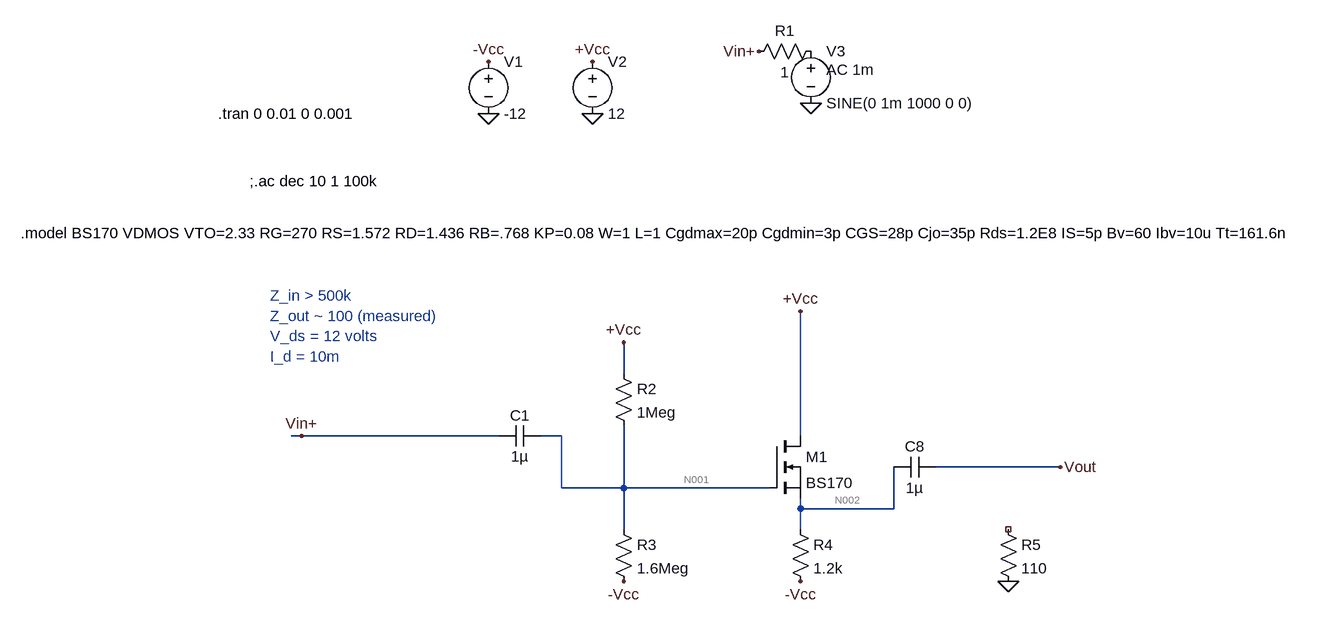
[diagram p0: schematic FET.asc]
FET.asc, the LTspice schematic file:
Version 4
SHEET 1 2740 1392
WIRE 256 688 256 640
WIRE -240 784 -256 784
WIRE 64 784 -240 784
WIRE 160 784 128 784
WIRE 528 784 528 592
WIRE 928 832 736 832
WIRE 160 864 160 784
WIRE 256 864 256 768
WIRE 256 864 160 864
WIRE 480 864 256 864
WIRE 528 896 528 880
WIRE 672 896 672 832
WIRE 672 896 528 896
WIRE 256 928 256 864
WIRE 528 928 528 896
FLAG 48 288 0
FLAG 208 288 0
FLAG 48 208 -Vcc
FLAG 208 208 +Vcc
FLAG 544 272 0
FLAG 464 192 Vin+
FLAG 256 640 +Vcc
FLAG 528 592 +Vcc
FLAG -240 784 Vin+
FLAG 928 832 Vout
FLAG 256 1008 -Vcc
FLAG 528 1008 -Vcc
FLAG 848 1008 0
SYMBOL voltage 48 192 R0
WINDOW 123 0 0 Left 0
WINDOW 39 0 0 Left 0
SYMATTR InstName V1
SYMATTR Value -12
SYMBOL voltage 208 192 R0
WINDOW 123 0 0 Left 0
WINDOW 39 0 0 Left 0
SYMATTR InstName V2
SYMATTR Value 12
SYMBOL voltage 544 176 R0
WINDOW 123 24 44 Left 2
WINDOW 39 0 0 Left 0
SYMATTR Value2 AC 1m
SYMATTR InstName V3
SYMATTR Value SINE(0 1m 1000 0 0)
SYMBOL res 560 176 R90
WINDOW 0 0 56 VBottom 2
WINDOW 3 32 56 VTop 2
SYMATTR InstName R1
SYMATTR Value 1
SYMBOL nmos 480 784 R0
SYMATTR InstName M1
SYMATTR Value BS170
SYMBOL res 240 672 R0
SYMATTR InstName R2
SYMATTR Value 1Meg
SYMBOL res 240 912 R0
SYMATTR InstName R3
SYMATTR Value 1.6Meg
SYMBOL res 512 912 R0
SYMATTR InstName R4
SYMATTR Value 1.2k
SYMBOL cap 736 816 R90
WINDOW 0 0 32 VBottom 2
WINDOW 3 32 32 VTop 2
SYMATTR InstName C8
SYMATTR Value 1µ
SYMBOL cap 128 768 R90
WINDOW 0 0 32 VBottom 2
WINDOW 3 32 32 VTop 2
SYMATTR InstName C1
SYMATTR Value 1µ
SYMBOL res 832 912 R0
SYMATTR InstName R5
SYMATTR Value 110
TEXT -368 288 Left 2 !.tran 0 0.01 0 0.001
TEXT -672 472 Left 2 !.model BS170 VDMOS VTO=2.33 RG=270 RS=1.572 RD=1.436 RB=.768 KP=0.08 W=1 L=1 Cgdmax=20p Cgdmin=3p CGS=28p Cjo=35p Rds=1.2E8 IS=5p Bv=60 Ibv=10u Tt=161.6n
TEXT -320 392 Left 2 !;.ac dec 10 1 100k
TEXT -288 568 Left 2 ;Z_in > 500k\nZ_out ~ 100 (measured)\nV_ds = 12 volts\nI_d = 10m

The netlist it stands for:
* FET.asc
V1 -Vcc 0 -12
V2 +Vcc 0 12
V3 P001 0 SINE(0 1m 1000 0 0) AC 1m
R1 P001 Vin+ 1
M1 +Vcc N001 N002 N002 BS170
R2 +Vcc N001 1Meg
R3 N001 -Vcc 1.6Meg
R4 N002 -Vcc 1.2k
C8 Vout N002 1µ
C1 N001 Vin+ 1µ
R5 NC_01 0 110
.model NMOS NMOS
.model PMOS PMOS
.lib standard.mos
.tran 0 0.01 0 0.001
.model BS170 VDMOS VTO=2.33 RG=270 RS=1.572 RD=1.436 RB=.768 KP=0.08 W=1 L=1 Cgdmax=20p Cgdmin=3p CGS=28p Cjo=35p Rds=1.2E8 IS=5p Bv=60 Ibv=10u Tt=161.6n
;.ac dec 10 1 100k
* Z_in > 500k
* Z_out ~ 100 (measured)
* V_ds = 12 volts
* I_d = 10m
.backanno
.end

* Results of the author's LTspice run, read from the files saved beside the schematic
* Operating Point, zero values left out:
*   V(-vcc) = -12 V
*   V(+vcc) = 12 V
*   V(n001) = 2.769 V
*   V(n002) = -74.83 mV
*   V(vout) = -74.83 nV
*   Id(M1) = 9.938 mA
*   Is(M1) = -9.938 mA
*   I(R4) = 9.938 mA
*   I(R3) = 9.231 µA
*   I(R2) = 9.231 µA
*   I(V2) = -9.947 mA
*   I(V1) = 9.947 mA